# EAGLE schematic condemore (EAGLE 7.3.0)
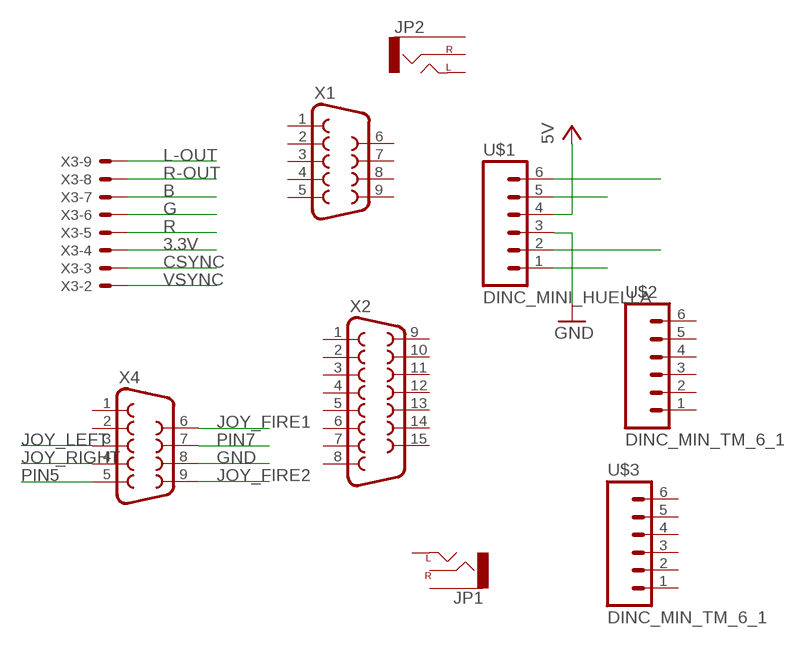
[diagram p0: schematic, sheet 1]

## Parts
JP1  AUDIO-JACK_HUELLAPTH  [AUDIO-JACK_HUELLA]
JP2  AUDIO-JACKPTH  [AUDIO-JACK]
U$1  DINC_MINI_HUELLA  [DINC/MIN_TM/6_1PRIMARY_HUELLA]
U$2  DINC_MIN_TM_6_1  [DINC/MIN_TM/6_1PRIMARY]
U$3  DINC_MIN_TM_6_1  [DINC/MIN_TM/6_1PRIMARY]
X1  DB9MALE  [DB9_MALE]
X2  F15HDH  [HDF15H]
X3  53048-09_HUELLA  [53048-09_HUELLA]
X4  DB9MALE  [DB9_MALE]

## Nets
3.3V: X3.4
5V: U$1.4
B: X3.7
CSYNC: X3.3
G: X3.6
GND: U$1.3 X4.8
JOY_FIRE1: X4.6
JOY_FIRE2: X4.9
JOY_LEFT: X4.3
JOY_RIGHT: X4.4
L-OUT: X3.9
N$1: U$1.6
N$2: U$1.5
N$3: U$1.2
N$4: U$1.1
PIN5: X4.5
PIN7: X4.7
R: X3.5
R-OUT: X3.8
VSYNC: X3.2
Unconnected: JP1.TIP(LEFT) JP2.RING(RIGHT) JP2.SLEEVE JP2.TIP(LEFT) U$2.1 U$2.2 U$2.3 U$2.4 U$2.5 U$2.6 U$3.1 U$3.2 U$3.3 U$3.4 U$3.5 U$3.6 X1.1 X1.2 X1.3 X1.4 X1.5 X1.6 X1.7 X1.8 X1.9 X2.1 X2.2 X2.3 X2.4 X2.5 X2.6 X2.7 X2.8 X2.9 X2.10 X2.11 X2.12 X2.13 X2.14 X2.15 X4.1 X4.2

## Library data of the parts
JP1 = SparkFun-Connectors_huella:AUDIO-JACK_HUELLA: 3.5mm Audio Jack Simple 3.5mm common PCB mount audio jack. SKU: PRT-08032
JP2 = SparkFun-Connectors:AUDIO-JACK: 3.5mm Audio Jack Simple 3.5mm common PCB mount audio jack. SKU: PRT-08032
U$1 = ZX_UNO_0_14_huella:DINC_MINI_HUELLA
U$2 U$3 = ZX_UNO_0_14:DINC_MIN_TM_6_1
X1 = SparkFun-Connectors:DB9: DB9 Connector Standard DB9 (D-Sub 9) serial connector. Can be used for CAN bus as well as RS485 and RS232. Footprint production proven. Spark Fun Electronics SKU : PRT-00429
X2 = con-subd:F15: SUB-D; OC_FARNELL: unknown; OC_NEWARK: unknown
X3 = con-molex_huella:53?-09_HUELLA: CONNECTOR wire to board 1.25 mm (.049 inch) pitch header; MPN: 53048-0910; OC_FARNELL: 1012239; OC_NEWARK: 98K9837
X4 = SparkFun-Connectors_huella:DB9: DB9 Connector Standard DB9 (D-Sub 9) serial connector. Can be used for CAN bus as well as RS485 and RS232. Footprint production proven. Spark Fun Electronics SKU : PRT-00429